# EAGLE design LightController (EAGLE 5.11)
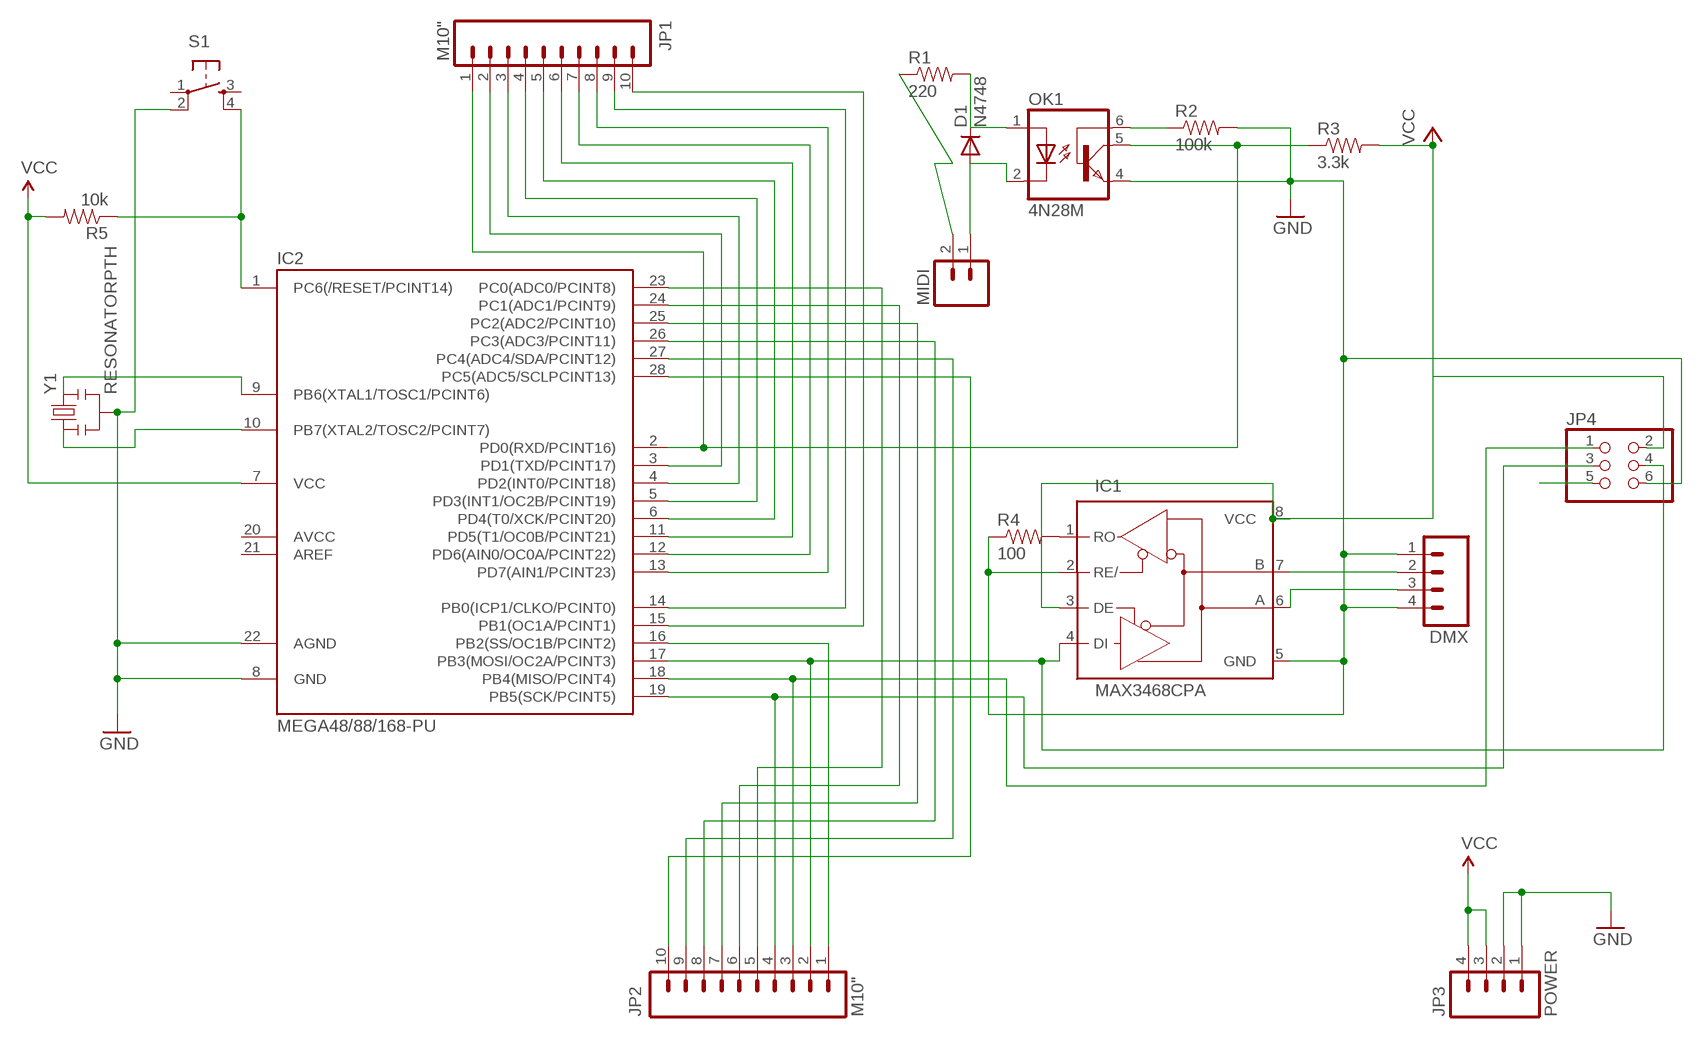
[diagram p0: schematic, sheet 1]

## Parts
D1  N4748  DIODE1N4148  [DIODE-1N4148]
DMX  M04LONGPADS  [1X04_LONGPADS]
IC1  MAX3468CPA  [DIL08]
IC2  MEGA48/88/168-PU  [DIL28-3]
JP1  M10"  [1X10]
JP2  M10"  [1X10]
JP3  POWER  M04PTH  [1X04]
JP4  PINHD-2X3  [2X03]
MIDI  M02LOCK_LONGPADS  [1X02_LOCK_LONGPADS]
OK1  4N28M  [DIL06]
R1  220  RESISTORAXIAL-0.3  [AXIAL-0.3]
R2  100k  RESISTORAXIAL-0.3  [AXIAL-0.3]
R3  3.3k  RESISTORAXIAL-0.3  [AXIAL-0.3]
R4  100  RESISTORAXIAL-0.3  [AXIAL-0.3]
R5  10k  RESISTORAXIAL-0.3  [AXIAL-0.3]
S1  TAC_SWITCHPTH  [TACTILE-PTH]
Y1  RESONATORPTH  [RESONATOR-PTH]

## Nets
GND: DMX.1 DMX.4 IC1.5(GND) IC2.8(GND) IC2.22(AGND) JP3.1 JP3.2 JP4.6 OK1.4(EMI) R2.P$2 R4.P$1 S1.2 Y1.2
N$1: D1.A MIDI.1 OK1.2(C)
N$2: D1.C OK1.1(A) R1.P$2
N$3: MIDI.2 R1.P$1
N$4: OK1.6(BAS) R2.P$1
N$5: IC2.2(PD0(RXD/PCINT16)) JP1.1 OK1.5(COL) R3.P$1
N$6: IC2.10(PB7(XTAL2/TOSC2/PCINT7)) Y1.1
N$7: IC2.9(PB6(XTAL1/TOSC1/PCINT6)) Y1.3
N$8: IC2.26(PC3(ADC3/PCINT11)) JP2.8
N$9: DMX.2 IC1.7(B)
N$10: DMX.3 IC1.6(A)
N$11: IC1.1(RO) R4.P$2
N$12: IC2.27(PC4(ADC4/SDA/PCINT12)) JP2.9
N$13: IC2.28(PC5(ADC5/SCLPCINT13)) JP2.10
N$14: IC1.4(DI) IC2.17(PB3(MOSI/OC2A/PCINT3)) JP2.2 JP4.4
N$16: IC1.2(RE/)
N$17: IC2.3(PD1(TXD/PCINT17)) JP1.2
N$18: IC2.4(PD2(INT0/PCINT18)) JP1.3
N$19: IC2.5(PD3(INT1/OC2B/PCINT19)) JP1.4
N$20: IC2.6(PD4(T0/XCK/PCINT20)) JP1.5
N$21: IC2.11(PD5(T1/OC0B/PCINT21)) JP1.6
N$22: IC2.12(PD6(AIN0/OC0A/PCINT22)) JP1.7
N$23: IC2.13(PD7(AIN1/PCINT23)) JP1.8
N$24: IC2.14(PB0(ICP1/CLKO/PCINT0)) JP1.9
N$25: IC2.15(PB1(OC1A/PCINT1)) JP1.10
N$26: IC2.16(PB2(SS/OC1B/PCINT2)) JP2.1
N$27: IC2.18(PB4(MISO/PCINT4)) JP2.3 JP4.1
N$28: IC2.19(PB5(SCK/PCINT5)) JP2.4 JP4.3
N$29: IC2.23(PC0(ADC0/PCINT8)) JP2.5
N$30: IC2.24(PC1(ADC1/PCINT9)) JP2.6
N$31: IC2.25(PC2(ADC2/PCINT10)) JP2.7
RST: IC2.1(PC6(/RESET/PCINT14)) JP4.5 R5.P$1 S1.4
VCC: IC1.3(DE) IC1.8(VCC) IC2.7(VCC) JP3.3 JP3.4 JP4.2 R3.P$2 R5.P$2
Unconnected: IC2.20(AVCC) IC2.21(AREF) S1.1 S1.3

## Library data of the parts
D1 = SparkFun:DIODE: Diode These are standard reverse protection diodes and small signal diodes. SMA package can handle up to about 1A. SOD-323 can handle about 200mA. What the SOD-323 package when ordering, there are some mfgs out there that are 5-pin packages.
DMX JP3 = SparkFun:M04: Header 4 Standard 4-pin 0.1" header. Use with straight break away headers (SKU : PRT-00116), right angle break away headers (PRT-00553), swiss pins (PRT-00743), machine pins (PRT-00117), and female headers (PRT-00115). Molex polarized connector foot print use with SKU : PRT-08231 with associated crimp pins and housings. 1MM SMD Version SKU: PRT-10208
IC1 = maxim:MAX34*: +5V, Fail-Safe, 40Mbps, Profibus RS-485/RS-422 Transceivers Source: MAX3465-MAX3469.pdf; OC_FARNELL: unknown; OC_NEWARK: unknown
IC2 = avr-7:MEGA48/88/168-PU
JP1 JP2 = SparkFun:M10: Header 10 Standard 10-pin 0.1" header. Use with straight break away headers (SKU : PRT-00116), right angle break away headers (PRT-00553), swiss pins (PRT-00743), machine pins (PRT-00117), and female headers (PRT-00115).
JP4 = SparkFun:PINHD-2X3: PIN HEADER
MIDI = SparkFun:M02: Header 2 Standard 2-pin 0.1" header. Use with straight break away headers (SKU : PRT-00116), right angle break away headers (PRT-00553), swiss pins (PRT-00743), machine pins (PRT-00117), and female headers (PRT-00115). Molex polarized connector foot print use with SKU : PRT-08233 with associated crimp pins and housings.
OK1 = optocoupler:4N*?M: General Purpose 6-Pin Phototransistor Optocouplers Source: http://www.fairchildsemi.com/ds/4N/4N35-M.pdf; MF: FAIRCHILD SEMICONDUCTOR; MPN: 4N28-M; OC_FARNELL: 1504445; OC_NEWARK: 05C3313
R1-R5 = SparkFun:RESISTOR: Resistor Basic schematic elements and footprints for 0603, 1206, and PTH resistors.
S1 = SparkFun:TAC_SWITCH: Momentary Switch Button commonly used for reset or general input. Spark Fun Electronics SKU : COM-00097
Y1 = SparkFun:RESONATOR: Resonator Small SMD resonator. This is the itty bitty 10/20MHz resonators with built in caps. CSTCE10M0G55 and CSTCE20M0V53. Footprint has been reviewed closely but hasn't been tested yet.

## Net classes
0 default: width 0.508 mm, drill 0.254 mm, clearance 0.254 mm

## Board
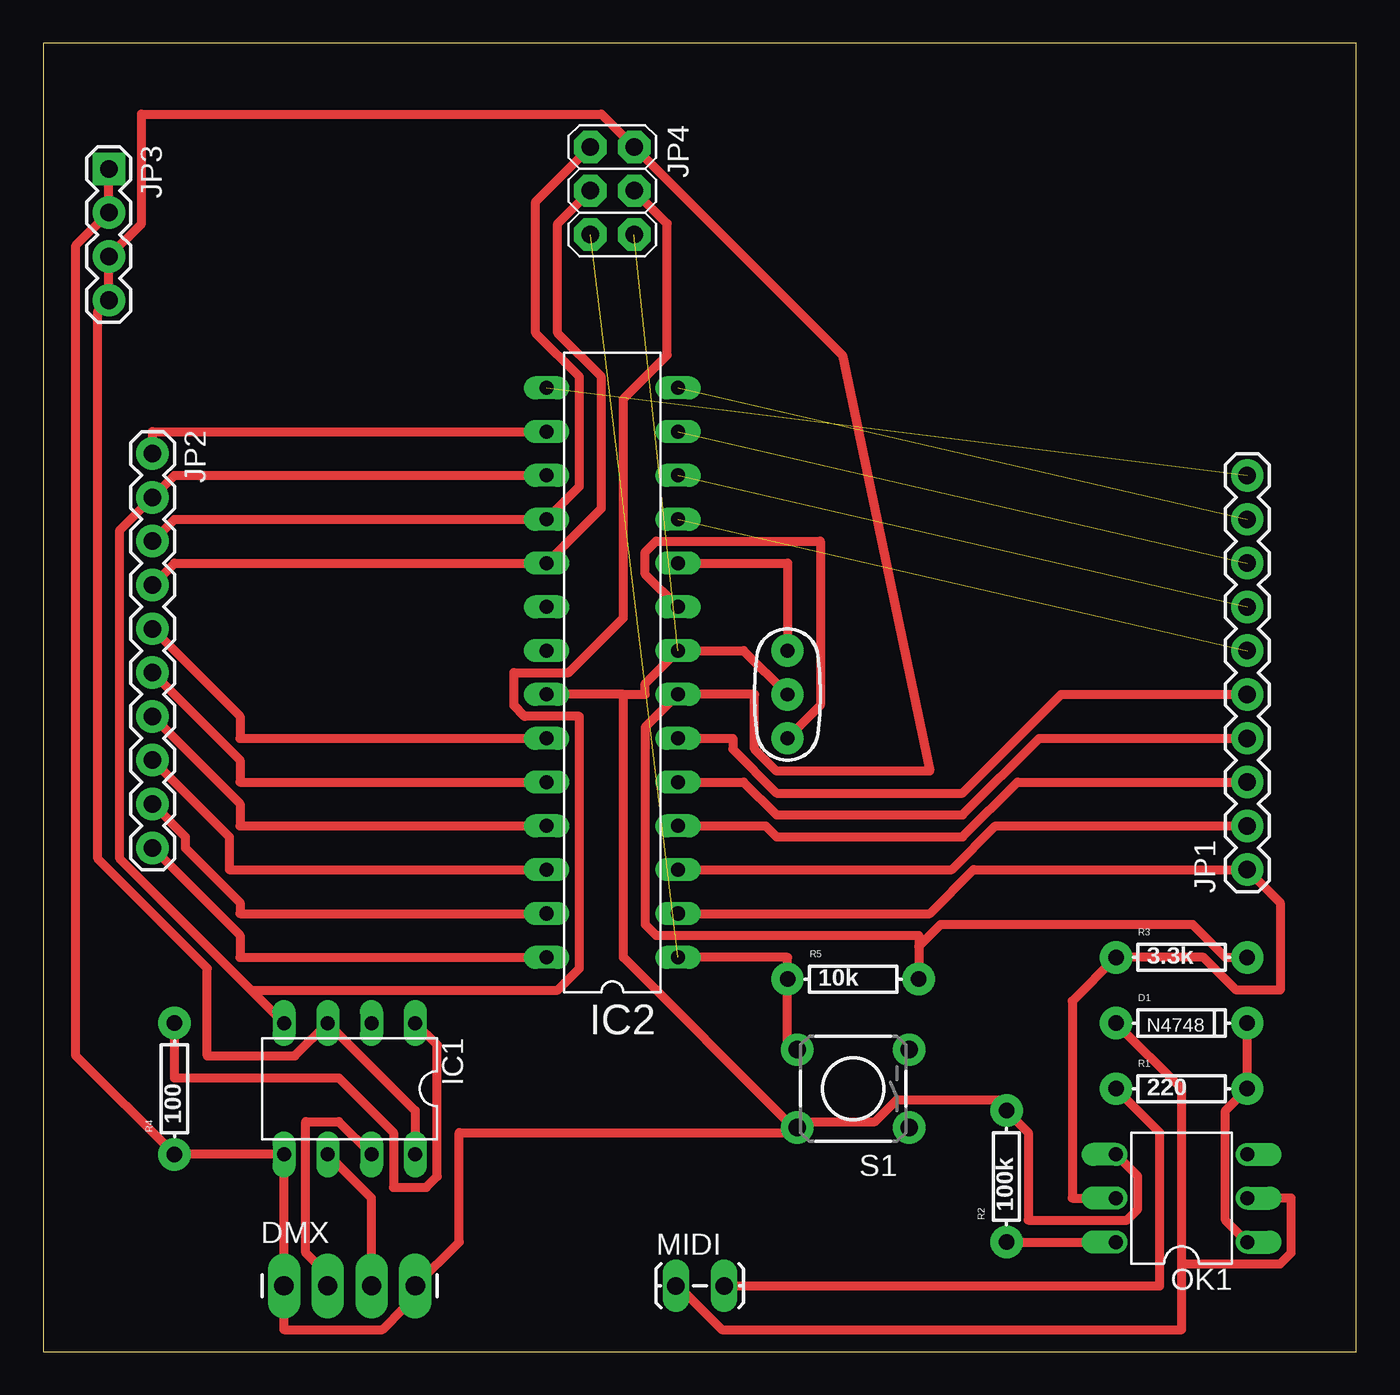
[diagram p1: board, top side]

Size 76.18 x 75.87 mm. Coordinates in mm from the lower left corner, seen from the top.
Outline: 0,0 76.18,0 76.18,75.87 0,75.87 0,0
Copper layers (1*16): Top 0.035mm / dielectric 1.5mm / Bottom 0.035mm
Design rules "default": minimum track width 10mil, minimum drill 24mil, track to track 8mil, track to pad 8mil, pad to pad 8mil, via to via 8mil, smd to smd 8mil, copper to edge 40mil, drill to drill 8mil, minimum pad ring 10mil, minimum via ring 8mil, stop-mask expansion 4mil, vias tented up to drill 0mil, thermal gap 10mil

### Footprints (pad centres in the part's own frame; a part is rotated, then mirrored left to right if it is on the bottom)
DIODE-1N4148 = drill 0.9 pad 1.88 round: A -3.81,0; C 3.81,0
1X04_LONGPADS = drill 1.118 pad 1.88 long: 1 0,0; 2 2.54,0; 3 5.08,0; 4 7.62,0
DIL08 = drill 0.813 long: 1 -3.81,-3.81; 2 -1.27,-3.81; 3 1.27,-3.81; 4 3.81,-3.81; 5 3.81,3.81; 6 1.27,3.81; 7 -1.27,3.81; 8 -3.81,3.81
DIL28-3 = drill 0.813 long: 1 -16.51,-3.81; 2 -13.97,-3.81; 3 -11.43,-3.81; 4 -8.89,-3.81; 5 -6.35,-3.81; 6 -3.81,-3.81; 7 -1.27,-3.81; 8 1.27,-3.81; 9 3.81,-3.81; 10 6.35,-3.81; 11 8.89,-3.81; 12 11.43,-3.81; 13 13.97,-3.81; 14 16.51,-3.81; 15 16.51,3.81; 16 13.97,3.81; 17 11.43,3.81; 18 8.89,3.81; 19 6.35,3.81; 20 3.81,3.81; 21 1.27,3.81; 22 -1.27,3.81; 23 -3.81,3.81; 24 -6.35,3.81; 25 -8.89,3.81; 26 -11.43,3.81; 27 -13.97,3.81; 28 -16.51,3.81
1X10 = drill 1.016 pad 1.88 round: 1 0,0; 2 2.54,0; 3 5.08,0; 4 7.62,0; 5 10.16,0; 6 12.7,0; 7 15.24,0; 8 17.78,0; 9 20.32,0; 10 22.86,0
1X04 = drill 1.016 pad 1.88 square: 1 0,0 | drill 1.016 pad 1.88 round: 2 2.54,0; 3 5.08,0; 4 7.62,0
2X03 = drill 1.016 pad 1.88 octagon: 1 -2.54,-1.27; 2 -2.54,1.27; 3 0,-1.27; 4 0,1.27; 5 2.54,-1.27; 6 2.54,1.27
1X02_LOCK_LONGPADS = drill 1.016 long: 1 -0.127,0; 2 2.667,0
DIL06 = drill 0.813 offset: 1 -2.54,-3.81; 2 0,-3.81; 3 2.54,-3.81; 4 2.54,3.81; 5 0,3.81; 6 -2.54,3.81
AXIAL-0.3 = drill 0.9 pad 1.88 round: P$1 -3.81,0; P$2 3.81,0
TACTILE-PTH = drill 1.016 pad 1.88 round: 1 -3.251,2.261; 2 3.251,2.261; 3 -3.251,-2.261; 4 3.251,-2.261
RESONATOR-PTH = drill 0.8 pad 1.88 round: 1 -2.54,0; 2 0,0; 3 2.54,0

### Placement (x,y rotation side)
D1  66.04,19.05 0 top
DMX  13.97,3.81 0 top
IC1  17.78,15.24 180 top
IC2  33.02,39.37 90 top
JP1  69.85,27.94 90 top
JP2  6.35,52.07 270 top
JP3  3.81,68.58 270 top
JP4  33.02,67.31 270 top
MIDI  36.83,3.81 0 top
OK1  66.04,8.89 90 top
R1  66.04,15.24 0 top
R2  55.88,10.16 90 top
R3  66.04,22.86 0 top
R4  7.62,15.24 90 top
R5  46.99,21.59 0 top
S1  46.99,15.24 180 top
Y1  43.18,38.1 270 top

### Tracks (layer width: path | path; a pad name or v marks a point on that pad's centre or on a via)
GND  (1 unrouted)
  Top 0.508: 33.66,38.1 34.92,38.1 34.92,38.73 IC2.8 40.64,40.64 Y1.2 | 33.66,38.1 IC2.22 | OK1.4 63.5,10.16 63.5,8.26 62.87,7.62 57.15,7.62 57.15,12.7 R2.P$2 55.88,14.61 49.53,14.61 48.26,13.34 43.81,13.34 S1.2 | 33.66,38.1 33.66,22.86 43.18,13.34 S1.2 | JP3.1 JP3.2 1.91,64.14 1.91,17.14 R4.P$1 IC1.5 DMX.1 13.97,1.27 19.68,1.27 20.95,2.54 20.95,3.17 DMX.4 24.13,6.35 24.13,12.7 43.18,12.7 S1.2
N$1
  Top 0.508: OK1.2 72.39,8.89 72.39,5.71 71.75,5.08 66.04,5.08 | 66.04,5.08 66.04,15.24 D1.A | 66.04,5.08 66.04,1.27 39.37,1.27 36.83,3.81 MIDI.1
N$2
  Top 0.508: OK1.1 68.58,7.62 68.58,13.97 R1.P$2 D1.C
N$3
  Top 0.508: R1.P$1 64.77,12.7 64.77,3.81 MIDI.2
N$4
  Top 0.508: R2.P$1 OK1.6
N$5
  Top 0.508: OK1.5 59.69,8.89 59.69,20.32 R3.P$1 67.31,22.86 69.22,20.95 71.75,20.95 71.75,26.04 JP1.1 53.98,27.94 51.44,25.4 IC2.2
N$6
  Top 0.508: IC2.10 43.18,45.72 Y1.1
N$7
  Top 0.508: IC2.9 34.92,45.09 34.92,46.35 35.56,46.99 45.09,46.99 45.09,37.47 Y1.3
N$8
  Top 0.508: IC2.26 10.79,27.94 10.79,29.84 JP2.8
N$9
  Top 0.508: IC1.7 17.14,13.34 15.24,13.34 15.24,5.71 16.51,4.45 DMX.2
N$10
  Top 0.508: IC1.6 19.05,8.89 DMX.3
N$11
  Top 0.508: IC1.1 22.86,17.78 22.86,10.16 22.23,9.53 20.32,9.53 20.32,12.7 17.14,15.88 7.62,15.88 R4.P$2
N$12
  Top 0.508: IC2.27 11.43,25.4 11.43,26.04 8.26,29.21 8.26,29.84 JP2.9
N$13
  Top 0.508: IC2.28 11.43,22.86 11.43,24.13 JP2.10
N$14
  Top 0.508: 12.06,20.95 4.45,28.57 4.45,47.62 JP2.2 7.62,50.8 IC2.17 | IC1.4 12.06,20.95 | JP4.4 36.2,65.41 36.2,57.78 33.66,55.24 33.66,42.55 30.48,39.37 27.3,39.37 27.3,37.47 27.94,36.83 31.11,36.83 31.11,22.23 29.84,20.95 12.06,20.95
N$17
  Top 0.508: IC2.3 52.7,27.94 55.24,30.48 JP1.2
N$18
  Top 0.508: IC2.4 41.91,30.48 42.55,29.84 53.34,29.84 56.52,33.02 JP1.3
N$19
  Top 0.508: IC2.5 40.64,33.02 42.55,31.11 53.34,31.11 57.78,35.56 JP1.4
N$20
  Top 0.508: IC2.6 40.01,35.56 40.01,34.92 42.55,32.38 53.34,32.38 59.05,38.1 JP1.5
N$21  (1 unrouted)
N$22  (1 unrouted)
N$23  (1 unrouted)
N$24  (1 unrouted)
N$25  (1 unrouted)
N$26
  Top 0.508: IC2.16 6.35,53.34 JP2.1
N$27
  Top 0.508: JP2.3 7.62,48.26 IC2.18 31.11,50.16 31.11,56.52 28.57,59.05 28.57,66.67 JP4.1
N$28
  Top 0.508: JP2.4 7.62,45.72 IC2.19 32.38,48.9 32.38,56.52 29.84,59.05 29.84,65.41 JP4.3
N$29
  Top 0.508: IC2.23 11.43,35.56 11.43,36.83 JP2.5
N$30
  Top 0.508: IC2.24 11.43,33.02 11.43,34.29 JP2.6
N$31
  Top 0.508: IC2.25 11.43,30.48 11.43,31.75 JP2.7
RST  (1 unrouted)
  Top 0.508: IC2.1 43.18,22.86 R5.P$1 43.18,17.78 S1.4
VCC
  Top 0.508: 50.8,23.5 R5.P$2 | 50.8,23.5 50.8,24.13 35.56,24.13 34.92,24.77 34.92,36.2 IC2.7 41.27,38.1 41.27,34.92 42.55,33.66 51.44,33.66 46.35,57.78 JP4.2 32.38,71.75 5.71,71.75 5.71,65.41 JP3.3 JP3.4 3.17,60.33 3.17,28.57 9.53,22.23 9.53,17.14 14.61,17.14 IC1.3 21.59,13.97 IC1.8 | R3.P$2 68.58,22.86 66.67,24.77 52.07,24.77 50.8,23.5